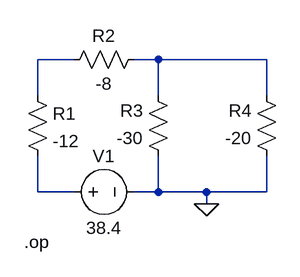
[diagram p0: schematic Draft3.asc]
Draft3.asc, the LTspice schematic file:
Version 4
SHEET 1 880 680
WIRE 144 96 96 96
WIRE 256 96 224 96
WIRE 400 96 256 96
WIRE 96 144 96 96
WIRE 256 144 256 96
WIRE 400 144 400 96
WIRE 96 272 96 224
WIRE 144 272 96 272
WIRE 256 272 256 224
WIRE 256 272 224 272
WIRE 320 272 256 272
WIRE 400 272 400 224
WIRE 400 272 320 272
WIRE 320 288 320 272
FLAG 320 288 0
SYMBOL res 80 128 R0
SYMATTR InstName R1
SYMATTR Value -12
SYMBOL res 240 80 R90
WINDOW 0 0 56 VBottom 2
WINDOW 3 32 56 VTop 2
SYMATTR InstName R2
SYMATTR Value -8
SYMBOL res 272 240 R180
WINDOW 0 36 76 Left 2
WINDOW 3 36 40 Left 2
SYMATTR InstName R3
SYMATTR Value -30
SYMBOL res 416 240 R180
WINDOW 0 36 76 Left 2
WINDOW 3 36 40 Left 2
SYMATTR InstName R4
SYMATTR Value -20
SYMBOL voltage 128 272 R270
WINDOW 0 32 56 VTop 2
WINDOW 3 -32 56 VBottom 2
SYMATTR InstName V1
SYMATTR Value 38.4
TEXT 78 338 Left 2 !.op

The netlist it stands for:
* Draft3.asc
R1 N001 N003 -12
R2 N002 N001 -8
R3 0 N002 -30
R4 0 N002 -20
V1 N003 0 38.4
.op
.backanno
.end